# Altium project STM32_Serial_Ethernet.PrjPcb
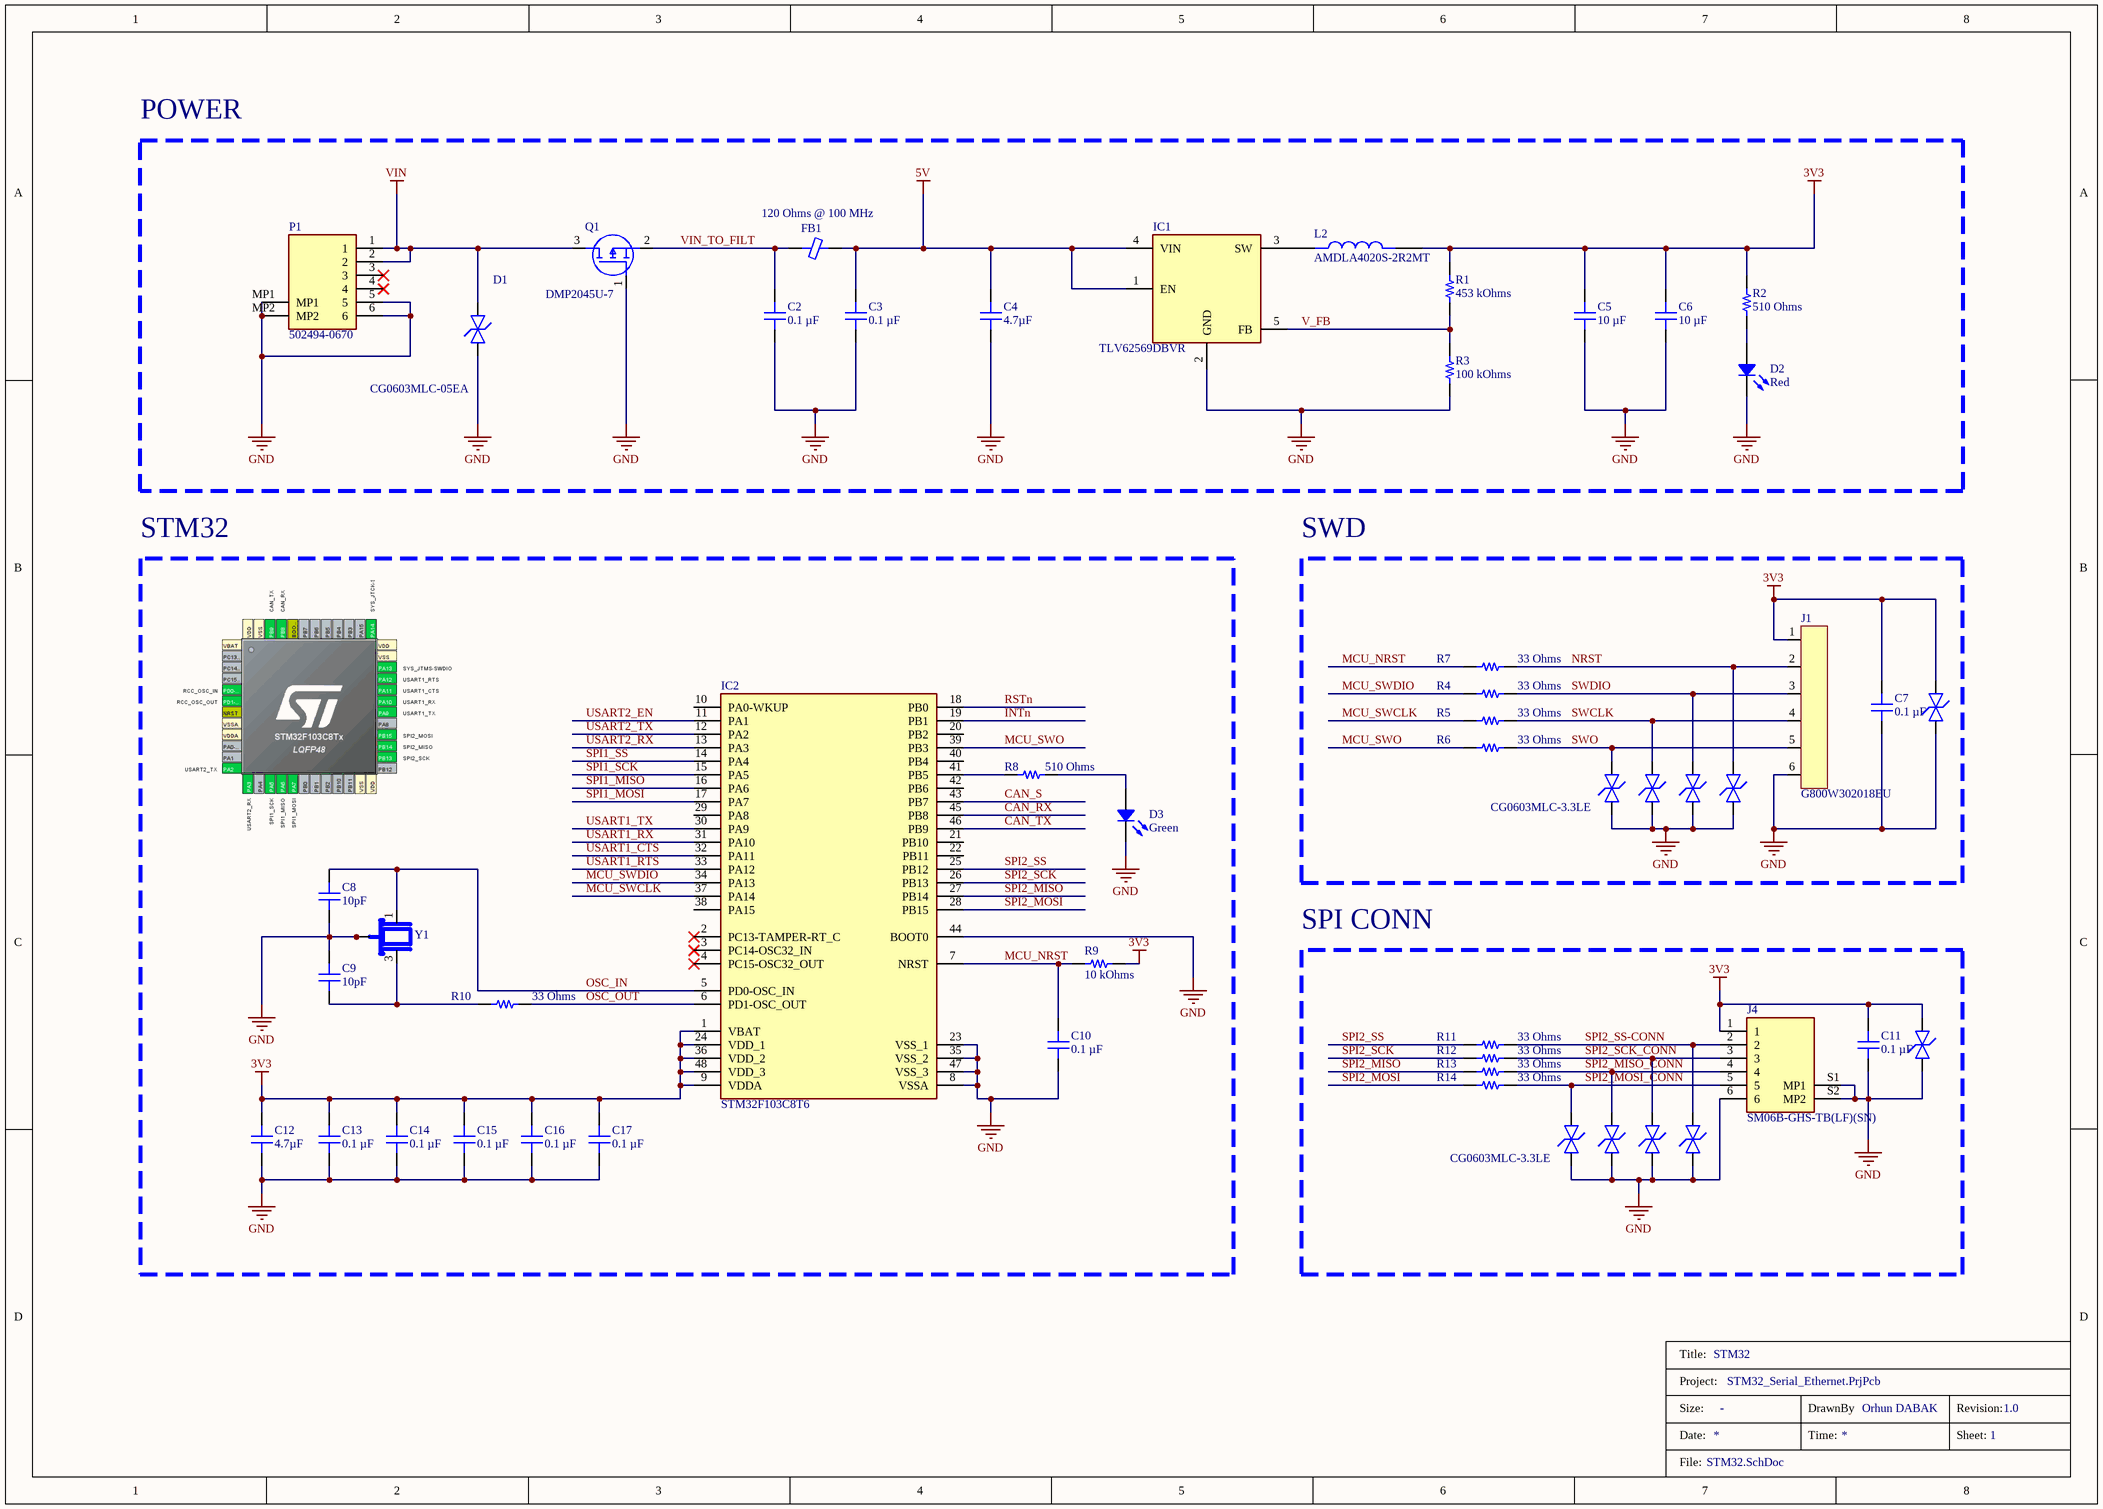
[diagram p0: STM32.SchDoc]
3 sheets, 124 parts. Net scope: global (net labels, ports and power ports of the same name join across sheets).
Board file: STM32_Serial_Ethernet.PcbDoc
Sheets:
  STM32.SchDoc
  Ethernet.SchDoc
  Serial.SchDoc

## Sheet STM32.SchDoc: STM32
size A3; Author: Orhun DABAK; DrawnBy: Orhun DABAK; Revision: 1.0; SheetNumber: 1; SheetTotal: 3

### Parts
(Parts that share a designator on the sheet are numbered #1, #2 ... from top to bottom, then left to right.)
*#1  Title_Block  (value not drawn)  (graphical)
C2  0.1 µF  [CAP 0603_1608]
C3  0.1 µF  [CAP 0603_1608]
C4  4.7µF  [CAP 0805_2012]
C5  10 µF  [CAP 0805_2012]
C6  10 µF  [CAP 0805_2012]
C7  0.1 µF  [CAP 0603_1608]
C8  10pF  [CAP 0603_1608]
C9  10pF  [CAP 0603_1608]
C10  0.1 µF  [CAP 0603_1608]
C11  0.1 µF  [CAP 0603_1608]
C12  4.7µF  [CAP 0805_2012]
C13  0.1 µF  [CAP 0603_1608]
C14  0.1 µF  [CAP 0603_1608]
C15  0.1 µF  [CAP 0603_1608]
C16  0.1 µF  [CAP 0603_1608]
C17  0.1 µF  [CAP 0603_1608]
D1  CG0603MLC-05EA  [DIONC1608X55N]
D2  Red  [LED 0603_1608 RED]
D3  Green  [LED 0603_1608 GREEN]
FB1  120 Ohms @ 100 MHz  [FER 0603_1608]
IC1  TLV62569DBVR  [SOT95P280X145-5N]
IC2  STM32F103C8T6  [QFP50P900X900X160-48N]
J1  G800W302018EU  [G800W302018EU]
J4  SM06B-GHS-TB(LF)(SN)  [JST_SM06B-GHS-TB(LF)(SN)]
L2  AMDLA4020S-2R2MT  [IND_AMDLA4020S-2R2MT]
P1  502494-0670  [MOLEX_502494-0670]
Q1  DMP2045U-7  [SOT96P240X110-3N]
R1  453 kOhms  [RES 0603_1608]
R2  510 Ohms  [RES 0603_1608]
R3  100 kOhms  [RES 0603_1608]
R4  33 Ohms  [RES 0603_1608]
R5  33 Ohms  [RES 0603_1608]
R6  33 Ohms  [RES 0603_1608]
R7  33 Ohms  [RES 0603_1608]
R8  510 Ohms  [RES 0603_1608]
R9  10 kOhms  [RES 0603_1608]
R10  33 Ohms  [RES 0603_1608]
R11  33 Ohms  [RES 0603_1608]
R12  33 Ohms  [RES 0603_1608]
R13  33 Ohms  [RES 0603_1608]
R14  33 Ohms  [RES 0603_1608]
RV1  CG0603MLC-3.3LE  [VARC1608X55N]  (value not drawn)
RV2  CG0603MLC-3.3LE  [VARC1608X55N]
RV3  CG0603MLC-3.3LE  [VARC1608X55N]  (value not drawn)
RV4  CG0603MLC-3.3LE  [VARC1608X55N]  (value not drawn)
RV5  CG0603MLC-3.3LE  [VARC1608X55N]  (value not drawn)
RV6  CG0603MLC-3.3LE  [VARC1608X55N]  (value not drawn)
RV7  CG0603MLC-3.3LE  [VARC1608X55N]
RV8  CG0603MLC-3.3LE  [VARC1608X55N]  (value not drawn)
RV9  CG0603MLC-3.3LE  [VARC1608X55N]  (value not drawn)
RV10  CG0603MLC-3.3LE  [VARC1608X55N]  (value not drawn)
Y1  X322516MLB4SI  [X322516MLB4SI]  (value not drawn)

### Blocks framed on the sheet
POWER: C2-C6 D1 D2 FB1 IC1 L2 P1 Q1 R1-R3
STM32: C8-C10 C12-C17 D3 IC2 R8-R10 Y1
SWD: C7 J1 R4-R7 RV1-RV5
SPI CONN: C11 J4 R11-R14 RV6-RV10

### Nets
3V3: C5.2 C6.2 C7.1 C11.2 C12.2 C13.1 C14.1 C15.1 C16.1 C17.1 IC2.1(VBAT) IC2.9(VDDA) IC2.24(VDD_1) IC2.36(VDD_2) IC2.48(VDD_3) J1.1 J4.1 L2.2 R1.2 R2.2 R9.1 RV1.2 RV6.2
5V: C3.2 C4.2 FB1.2 IC1.1(EN) IC1.4(VIN)
GND: C2.1 C3.1 C4.1 C5.1 C6.1 C7.2 C8.1 C9.1 C10.2 C11.1 C12.1 C13.2 C14.2 C15.2 C16.2 C17.2 D1.1 D2.2 D3.2 IC1.2(GND) IC2.8(VSSA) IC2.23(VSS_1) IC2.35(VSS_2) IC2.44(BOOT0) IC2.47(VSS_3) J1.6 J4.6 J4.S1(MP1) J4.S2(MP2) P1.5 P1.6 P1.MP1 P1.MP2 Q1.1(G) R3.2 RV1.1 RV2.1 RV3.1 RV4.1 RV5.1 RV6.1 RV7.1 RV8.1 RV9.1 RV10.1 Y1.2(GND) Y1.4(GND)
VIN: D1.2 P1.1 P1.2 Q1.3(D)
CAN_RX: IC2.45(PB8)
CAN_S: IC2.43(PB7)
CAN_TX: IC2.46(PB9)
INTn: IC2.19(PB1)
MCU_NRST: C10.1 IC2.7(NRST) R7.1 R9.2
MCU_SWCLK: IC2.37(PA14) R5.1
MCU_SWDIO: IC2.34(PA13) R4.1
MCU_SWO: IC2.39(PB3) R6.1
NRST: J1.2 R7.2 RV2.2
OSC_IN: C8.2 IC2.5(PD0-OSC_IN) Y1.1
OSC_OUT: IC2.6(PD1-OSC_OUT) R10.2
RSTn: IC2.18(PB0)
SPI1_MISO: IC2.16(PA6)
SPI1_MOSI: IC2.17(PA7)
SPI1_SCK: IC2.15(PA5)
SPI1_SS: IC2.14(PA4)
SPI2_MISO: IC2.27(PB14) R13.1
SPI2_MISO_CONN: J4.4 R13.2 RV8.2
SPI2_MOSI: IC2.28(PB15) R14.1
SPI2_MOSI_CONN: J4.5 R14.2 RV7.2
SPI2_SCK: IC2.26(PB13) R12.1
SPI2_SCK_CONN: J4.3 R12.2 RV9.2
SPI2_SS: IC2.25(PB12) R11.1
SPI2_SS-CONN: J4.2 R11.2 RV10.2
SWCLK: J1.4 R5.2 RV4.2
SWDIO: J1.3 R4.2 RV5.2
SWO: J1.5 R6.2 RV3.2
USART1_CTS: IC2.32(PA11)
USART1_RTS: IC2.33(PA12)
USART1_RX: IC2.31(PA10)
USART1_TX: IC2.30(PA9)
USART2_EN: IC2.11(PA1)
USART2_RX: IC2.13(PA3)
USART2_TX: IC2.12(PA2)
V_FB: IC1.5(FB) R1.1 R3.1
VIN_TO_FILT: C2.2 FB1.1 Q1.2(S)
NetC9_2: C9.2 R10.1 Y1.3
NetD2_1: D2.1 R2.1
NetD3_1: D3.1 R8.1
NetIC1_3: IC1.3(SW) L2.1
NetIC2_41: IC2.41(PB5) R8.2

Not connected (* = marked no-connect by the designer): IC2 2(PC13-TAMPER-RT_C)* 3(PC14-OSC32_IN)* 4(PC15-OSC32_OUT)* 10(PA0-WKUP) 20(PB2) 21(PB10) 22(PB11) 29(PA8) 38(PA15) 40(PB4) 42(PB6); P1 3* 4*

### Notes on the sheet
- (in symbol Title_Block) Title:; Project:; Size:; DrawnBy; Revision:; Date:; Time:; Sheet:; File:

### Library data of the parts
*#1 = Title_Block: Standart Title Block; Size: -
C2 C3 C7 C10 C11 C13-C17 = CS0603KRX7R7BB104: CAP CER 0.1UF 16V X7R 0603; manufacturer: Yageo; Tolerance: ±10%; Part Number: CS0603KRX7R7BB104; Value: 0.1 µF; Applications: Boardflex Sensitive; Capacitance: 0.1 µF; componentlink1description: Datasheet; componentlink1url: http://www.yageo.com/NewPortal/yageodocoutput?fileName=/pdf/MLCC/UPY-ST_NPOX7R_16V-to-3KV_5.pdf; componentlink2description: DigiKey Link; componentlink2url: https://www.digikey.com/en/products/detail/yageo/CS0603KRX7R7BB104/6097897; Device Package: 0603 (1608 Metric); Features: Soft Termination; lastupdated: 3/3/2023 08:08:52 PM; Lifecycle Status: Active; Minimum Order: 1; Mounting Type: Surface Mount, MLCC; Operating Temperature: -55°C ~ 125°C; Package / Case: 0603 (1608 Metric); packaging: TapeAndReel; partid: 2286; Part Status: Active; price: 0.01; series: CS; Size / Dimension: 0.063" L x 0.031" W (1.60mm x 0.80mm); Supplier 1: DigiKey; Supplier Part Number 1: 311-3560-1-ND; Temperature Coefficient: X7R; Thickness (Max): 0.037" (0.95mm); Voltage - Rated: 16V
C4 C12 = 0805YC475MAT2A: CAP CER 4.7UF 16V X7R 0805; manufacturer: AVX Corporation; Tolerance: ±20%; Part Number: 0805YC475MAT2A; Value: 4.7µF; Applications: General Purpose; Capacitance: 4.7µF; componentlink1description: Datasheet; componentlink1url: http://datasheets.avx.com/X7RDielectric.pdf; componentlink2description: DigiKey Link; componentlink2url: http://digikey.com/product-detail/en/avx-corporation/0805YC475MAT2A/478-10575-1-ND/6797621; Device Package: 0805 (2012 Metric); lastupdated: 9/2/2020 01:04:40 AM; Lifecycle Status: Active; Minimum Order: 1; Mounting Type: Surface Mount, MLCC; Operating Temperature: -55°C ~ 125°C; Package / Case: 0805 (2012 Metric); packaging: TapeAndReel; partid: 3443; Part Status: Active; price: 0.12; series: -; Size / Dimension: 0.079" L x 0.049" W (2.01mm x 1.25mm); Supplier 1: DigiKey; Supplier Part Number 1: 478-10575-1-ND; Temperature Coefficient: X7R; Thickness (Max): 0.060" (1.52mm); Voltage - Rated: 16V
C5 C6 = C2012X6S1C106K125AC: CAP CER 10UF 16V X6S 0805; manufacturer: TDK Corporation; Tolerance: ±10%; Part Number: C2012X6S1C106K125AC; Value: 10 µF; Applications: General Purpose; Capacitance: 10 µF; componentlink1description: Datasheet; componentlink1url: https://product.tdk.com/info/en/catalog/datasheets/mlcc_commercial_general_en.pdf?ref_disty=digikey; componentlink2description: DigiKey Link; componentlink2url: https://www.digikey.com/en/products/detail/tdk-corporation/C2012X6S1C106K125AC/2733046; Device Package: 0805 (2012 Metric); Features: Low ESL; lastupdated: 3/3/2023 08:12:18 PM; Lifecycle Status: Active; Minimum Order: 1; Mounting Type: Surface Mount, MLCC; Operating Temperature: -55°C ~ 105°C; Package / Case: 0805 (2012 Metric); packaging: TapeAndReel; partid: 2995; Part Status: Active; price: 0.07; series: C; Size / Dimension: 0.079" L x 0.049" W (2.00mm x 1.25mm); Supplier 1: DigiKey; Supplier Part Number 1: 445-7611-1-ND; Temperature Coefficient: X6S; Thickness (Max): 0.057" (1.45mm); Voltage - Rated: 16V
C8 C9 = 06035A100J4T2A: CAP CER 10PF 50V NP0 0603; manufacturer: AVX Corporation; Temperature Coefficient: C0G, NP0; Tolerance: ±5%; Part Number: 06035A100J4T2A; Value: 10pF; Applications: Automotive; Capacitance: 10pF; componentlink1description: Datasheet; componentlink1url: http://datasheets.avx.com/AutoMLCC.pdf; componentlink2description: DigiKey Link; componentlink2url: http://digikey.com/product-detail/en/avx-corporation/06035A100J4T2A/478-11607-1-ND/8564165; Device Package: 0603 (1608 Metric); lastupdated: 9/2/2020 01:03:34 AM; Lifecycle Status: Active; Minimum Order: 1; Mounting Type: Surface Mount, MLCC; Operating Temperature: -55°C ~ 125°C; Package / Case: 0603 (1608 Metric); packaging: TapeAndReel; partid: 3073; Part Status: Active; price: 0.04; Ratings: AEC-Q200; series: -; Size / Dimension: 0.063" L x 0.031" W (1.60mm x 0.80mm); Supplier 1: DigiKey; Supplier Part Number 1: 478-11607-1-ND; Thickness (Max): 0.035" (0.90mm); Voltage - Rated: 50V
D1 = CG0603MLC-05EA: TVS Diode (Bi-directional); Manufacturer_Name: Bourns; Datasheet Link: https://datasheet.datasheetarchive.com/originals/dk/DKDS-12/224862.pdf; Height: 0.55mm; Manufacturer_Part_Number: CG0603MLC-05EA
D2 = LTST-C193KRKT-2A: LED RED CLEAR CHIP SMD; Manufacturer: Lite-On Inc.; Configuration: Standard; Current - Test: 2mA; Lens Color: Colorless; Lens Size: 1.15mm x 0.80mm; Lens Style: Rectangle with Flat Top; Millicandela Rating: 6.5mcd; Viewing Angle: 130°; Voltage - Forward (Vf) (Typ): 1.9V; Wavelength - Dominant: 629nm; Wavelength - Peak: 639nm; Part Number: LTST-C193KRKT-2A; Color: Red; ComponentLink1Description: Datasheet; ComponentLink1URL: //media.digikey.com/pdf/Data%20Sheets/Lite-On%20PDFs/LTST-C193KRKT-2A.pdf; ComponentLink2Description: DigiKey Link; ComponentLink2URL: http://digikey.com/product-detail/en/lite-on-inc/LTST-C193KRKT-2A/160-1909-1-ND/3694456; Device Package: 0603 (1608 Metric); Height (Max): 0.35mm; LastUpdated: 3/3/2023 08:56:33 PM; Lens Transparency: Clear; Lifecycle Status: Active; Minimum Order: 1; Mounting Type: Surface Mount; Package / Case: 0603 (1608 Metric); Packaging: TapeAndReel; PartId: 382; Part Status: Active; Price: 0.07; Series: -; Size / Dimension: 1.60mm L x 0.80mm W; Supplier 1: DigiKey; Supplier Part Number 1: 160-1909-1-ND; Supplier Device Package: Chip LED; Value: Red
D3 = LSM0603453V: LED SM 0603 3V -/1000/-MCD GREEN; Manufacturer: Visual Communications Company - VCC; Configuration: Standard; Current - Test: 20mA; Lens Color: Colorless; Lens Size: 1.20mm x 0.80mm; Lens Style: Rectangle with Flat Top; Lens Transparency: Clear; Millicandela Rating: 63mcd; Viewing Angle: 120°; Voltage - Forward (Vf) (Typ): 2V; Wavelength - Dominant: 572nm; Wavelength - Peak: 571nm; Part Number: LSM0603453V; Color: Green; ComponentLink1Description: Datasheet; ComponentLink1URL: https://vcclite.com/wp-content/uploads/wpallimport/files/files/LSM0603453V.pdf; ComponentLink2Description: DigiKey Link; ComponentLink2URL: https://www.digikey.com/en/products/detail/visual-communications-company-vcc/LSM0603453V/9486724; Device Package: 0603 (1608 Metric); Height (Max): 0.65mm; LastUpdated: 3/3/2023 08:56:02 PM; Lifecycle Status: Active; Minimum Order: 1; Mounting Type: Surface Mount; Package / Case: 0603 (1608 Metric); Packaging: TapeAndReel; PartId: 579; Part Status: Active; Price: 0.08; Series: LSM0603; Size / Dimension: 1.60mm L x 0.80mm W; Supplier 1: DigiKey; Supplier Part Number 1: LSM0603453VCT-ND; Supplier Device Package: Chip LED; Value: Green
FB1 = 742792625: FERRITE BEAD 120 OHM 0603 1LN; Manufacturer: Würth Elektronik; Current Rating (Max): 2A; DC Resistance (DCR) (Max): 50mOhm; Filter Type: Signal Line; Number of Lines: 1; Part Number: 742792625; ComponentLink1Description: Datasheet; ComponentLink1URL: https://katalog.we-online.de/pbs/datasheet/742792625.pdf; ComponentLink2Description: DigiKey Link; ComponentLink2URL: https://www.digikey.com/en/products/detail/würth-elektronik/742792625/4310426; Device Package: 0603 (1608 Metric); Height (Max): 0.039" (1.00mm); Impedance @ Frequency: 120 Ohms @ 100 MHz; LastUpdated: 3/3/2023 08:50:24 PM; Lifecycle Status: Active; Minimum Order: 1; Mounting Type: Surface Mount; Operating Temperature: -55°C ~ 125°C; Package / Case: 0603 (1608 Metric); Packaging: TapeAndReel; PartId: 1102; Part Status: Active; Price: 0.10; Ratings: AEC-Q200; Series: WE-CBF; Size / Dimension: 0.063" L x 0.032" W (1.60mm x 0.80mm); Supplier 1: DigiKey; Supplier Part Number 1: 732-4665-1-ND; Value: 120 Ohms @ 100 MHz
IC1 = TLV62569DBVR: Integrated Circuit; Manufacturer_Name: Texas Instruments; Datasheet Link: http://www.ti.com/lit/gpn/tlv62569; Height: 1.45mm; Manufacturer_Part_Number: TLV62569DBVR; Mouser Part Number: 595-TLV62569DBVR; Mouser Price/Stock: https://www.mouser.co.uk/ProductDetail/Texas-Instruments/TLV62569DBVR?qs=0C8XhJW8e4oaylc%252BzBrCmA%3D%3D; Arrow Part Number: TLV62569DBVR; Arrow Price/Stock: https://www.arrow.com/en/products/tlv62569dbvr/texas-instruments?region=nac
IC2 = STM32F103C8T6: Integrated Circuit; Manufacturer_Name: STMicroelectronics; Datasheet Link: https://www.st.com/resource/en/datasheet/stm32f103c8.pdf; Height: 1.6mm; Manufacturer_Part_Number: stm32f103c8t6; Mouser Part Number: 511-STM32F103C8T6; Mouser Price/Stock: https://www.mouser.co.uk/ProductDetail/STMicroelectronics/STM32F103C8T6?qs=bhCVus9SdFtq6kqxsU5%2FDA%3D%3D; Arrow Part Number: STM32F103C8T6; Arrow Price/Stock: https://www.arrow.com/en/products/stm32f103c8t6/stmicroelectronics?region=nac
J1 = G800W302018EU: Pin Header 6 Position 2.54mm Pitch; Manufacturer: Amphenol; Manufacturer Part Number: G800W302018EU
J4 = SM06B-GHS-TB(LF)(SN): ÐŸÐ¾Ð²ÐµÑ€Ñ…Ð½Ð¾ÑÑ‚Ð½Ñ‹Ð¹ Ð¼Ð¾Ð½Ñ‚Ð°Ð¶ Ñ€Ð°Ð·ÑŠÐµÐ¼Ð°, Ð¿Ñ€ÑÐ¼Ð¾Ð¹ ÑƒÐ³Ð¾Ð» 6, Ð¿Ð¾Ð»Ð¾Ð¶ÐµÐ½Ð¸Ðµ 0,049 _1,25 Ð¼Ð¼_; MP: SM06B-GHS-TB_LF__SN_; MF: JST Sales; Value: *; Package: None; Price: None; Availability: Unavailable; SnapEDA_Link: https://www.snapeda.com/parts/SM06B-GHS-TB%28LF%29%28SN%29/JST%20Sales%20America%20Inc./view-part/817690/?ref=snap
L2 = AMDLA4020S-2R2MT: Power Inductor (SMD), 2.2 uH, Â± 20%, 4.5 A, Shielded, 6 A, 4.4mm x 4mm x 1.8mm; MF: Abracon Corporation; Purchase-URL: https://pricing.snapeda.com/search/part/AMDLA4020S-2R2MT/?ref=eda; Package: Package; MP: AMDLA4020S-2R2MT; Value: *; SnapEDA_Link: https://www.snapeda.com/parts/AMDLA4020S-2R2MT/Abracon/view-part/?ref=snap; Availability: In Stock; Price: None; Check_prices: https://www.snapeda.com/parts/AMDLA4020S-2R2MT/Abracon/view-part/?ref=eda
P1 = 502494-0670: 2.00mm Pitch CLIK-Mateâ„¢ Wire-to-Board PCB Receptacle, Single Row, Right Angle, 6 Circuits; Package: None; Price: None; Value: *; MP: 502494-0670; Availability: Unavailable
Q1 = DMP2045U-7: MOSFET (P-Channel); Manufacturer_Name: Diodes Inc.; Datasheet Link: https://www.diodes.com/assets/Datasheets/DMP2045U.pdf; Height: 1.1mm; Manufacturer_Part_Number: DMP2045U-7; Mouser Part Number: 621-DMP2045U-7; Mouser Price/Stock: https://www.mouser.co.uk/ProductDetail/Diodes-Incorporated/DMP2045U-7?qs=rrS6PyfT74erdUwo5CgHTg%3D%3D; Arrow Part Number: DMP2045U-7; Arrow Price/Stock: https://www.arrow.com/en/products/dmp2045u-7/diodes-incorporated?region=nac
R1 = SDR03EZPF4533: RES SMD 453 KOHM 1% 0.3W 0603; Manufacturer: Rohm Semiconductor; Temperature Coefficient: ±100ppm/°C; Part Number: SDR03EZPF4533; Value: 453 kOhms; ComponentLink1Description: Datasheet; ComponentLink1URL: https://www.rohm.com/datasheet/SDR03EZPF/sdr-e; ComponentLink2Description: DigiKey Link; ComponentLink2URL: https://www.digikey.com/en/products/detail/rohm-semiconductor/SDR03EZPF4533/9674970; Composition: Thick Film; Device Package: 0603 (1608 Metric); Features: Pulse Withstanding; Height - Seated (Max): 0.022" (0.55mm); LastUpdated: 3/3/2023 08:29:48 PM; Lifecycle Status: Active; Minimum Order: 1; Number of Terminations: 2; Operating Temperature: -55°C ~ 155°C; Package / Case: 0603 (1608 Metric); Packaging: TapeAndReel; PartId: 5359; Part Status: Active; Power (Watts): 0.3W; Price: 0.02; Resistance: 453 kOhms; Series: SDR03; Size / Dimension: 0.063" L x 0.031" W (1.60mm x 0.80mm); Supplier 1: DigiKey; Supplier Part Number 1: 511-1720-1-ND; Supplier Device Package: 0603; Tolerance: ±1%
R2 R8 = RMCF0603JT510R: RES 510 OHM 5% 1/10W 0603; Manufacturer: Stackpole Electronics Inc; Power (Watts): 0.1W, 1/10W; Temperature Coefficient: ±200ppm/°C; Part Number: RMCF0603JT510R; Value: 510 Ohms; ComponentLink1Description: Datasheet; ComponentLink1URL: https://www.seielect.com/catalog/sei-rmcf_rmcp.pdf; ComponentLink2Description: DigiKey Link; ComponentLink2URL: https://www.digikey.com/en/products/detail/stackpole-electronics-inc/RMCF0603JT510R/1757941; Composition: Thick Film; Device Package: 0603 (1608 Metric); Features: Automotive AEC-Q200; Height - Seated (Max): 0.022" (0.55mm); LastUpdated: 3/3/2023 08:29:46 PM; Lifecycle Status: Active; Minimum Order: 1; Number of Terminations: 2; Operating Temperature: -55°C ~ 155°C; Package / Case: 0603 (1608 Metric); Packaging: CutTape; PartId: 5929; Part Status: Active; Price: 0.01; Ratings: AEC-Q200; Resistance: 510 Ohms; Series: RMCF; Size / Dimension: 0.061" L x 0.031" W (1.55mm x 0.80mm); Supplier 1: DigiKey; Supplier Part Number 1: RMCF0603JT510RCT-ND; Supplier Device Package: 0603; Tolerance: ±5%
R3 = RT0603FRE07100KL: RES SMD 100K OHM 1% 1/10W 0603; Manufacturer: Yageo; Power (Watts): 0.1W, 1/10W; Temperature Coefficient: ±50ppm/°C; Part Number: RT0603FRE07100KL; Value: 100 kOhms; ComponentLink1Description: Datasheet; ComponentLink1URL: https://www.yageo.com/upload/media/product/productsearch/datasheet/rchip/PYu-RT_1-to-0.01_RoHS_L_11.pdf; ComponentLink2Description: DigiKey Link; ComponentLink2URL: https://www.digikey.com/en/products/detail/yageo/RT0603FRE07100KL/1075029; Composition: Thin Film; Device Package: 0603 (1608 Metric); Height - Seated (Max): 0.022" (0.55mm); LastUpdated: 3/3/2023 08:29:47 PM; Lifecycle Status: Active; Minimum Order: 1; Number of Terminations: 2; Operating Temperature: -55°C ~ 155°C; Package / Case: 0603 (1608 Metric); Packaging: TapeAndReel; PartId: 5677; Part Status: Active; Price: 0.01; Resistance: 100 kOhms; Series: RT; Size / Dimension: 0.063" L x 0.031" W (1.60mm x 0.80mm); Supplier 1: DigiKey; Supplier Part Number 1: YAG2319CT-ND; Supplier Device Package: 0603; Tolerance: ±1%
R4-R7 R10-R14 = RMCF0603JT33R0: RES 33 OHM 5% 1/10W 0603; Manufacturer: Stackpole Electronics Inc; Power (Watts): 0.1W, 1/10W; Temperature Coefficient: ±200ppm/°C; Part Number: RMCF0603JT33R0; Value: 33 Ohms; ComponentLink1Description: Datasheet; ComponentLink1URL: https://www.seielect.com/catalog/sei-rmcf_rmcp.pdf; ComponentLink2Description: DigiKey Link; ComponentLink2URL: https://www.digikey.com/en/products/detail/stackpole-electronics-inc/RMCF0603JT33R0/1758048; Composition: Thick Film; Device Package: 0603 (1608 Metric); Features: Automotive AEC-Q200; Height - Seated (Max): 0.022" (0.55mm); LastUpdated: 3/3/2023 08:29:46 PM; Lifecycle Status: Active; Minimum Order: 1; Number of Terminations: 2; Operating Temperature: -55°C ~ 155°C; Package / Case: 0603 (1608 Metric); Packaging: CutTape; PartId: 5849; Part Status: Active; Price: 0.01; Ratings: AEC-Q200; Resistance: 33 Ohms; Series: RMCF; Size / Dimension: 0.061" L x 0.031" W (1.55mm x 0.80mm); Supplier 1: DigiKey; Supplier Part Number 1: RMCF0603JT33R0CT-ND; Supplier Device Package: 0603; Tolerance: ±5%
R9 = CRCW060310K0JNEA: RES SMD 10K OHM 5% 1/10W 0603; Manufacturer: Vishay Dale; Power (Watts): 0.1W, 1/10W; Temperature Coefficient: ±200ppm/°C; Part Number: CRCW060310K0JNEA; Value: 10 kOhms; ComponentLink1Description: Datasheet; ComponentLink1URL: http://www.vishay.com/docs/20035/dcrcwe3.pdf; ComponentLink2Description: DigiKey Link; ComponentLink2URL: http://digikey.com/product-detail/en/vishay-dale/CRCW060310K0JNEA/541-10KGCT-ND/1179393; Composition: Thick Film; Device Package: 0603 (1608 Metric); Features: Automotive AEC-Q200; Height - Seated (Max): 0.020" (0.50mm); LastUpdated: 3/3/2023 08:29:48 PM; Lifecycle Status: Active; Minimum Order: 1; Number of Terminations: 2; Operating Temperature: -55°C ~ 155°C; Package / Case: 0603 (1608 Metric); Packaging: CutTape; PartId: 5216; Part Status: Active; Price: 0.10; Ratings: AEC-Q200; Resistance: 10 kOhms; Series: CRCW; Size / Dimension: 0.063" L x 0.033" W (1.60mm x 0.85mm); Supplier 1: DigiKey; Supplier Part Number 1: 541-10KGCT-ND; Supplier Device Package: 0603; Tolerance: ±5%
RV1-RV10 = CG0603MLC-3.3LE: Varistor; Manufacturer_Name: Bourns; Datasheet Link: https://www.bourns.com/docs/Product-Datasheets/MLC.pdf; Height: 0.55mm; Manufacturer_Part_Number: CG0603MLC-3.3LE; Mouser Part Number: 652-CG0603MLC-3.3LE; Mouser Price/Stock: https://www.mouser.co.uk/ProductDetail/Bourns/CG0603MLC-3.3LE?qs=m8myXnDJXpXlL5%252BDNWWe1g%3D%3D; Arrow Part Number: CG0603MLC-3.3LE; Arrow Price/Stock: https://www.arrow.com/en/products/cg0603mlc-3.3le/bourns?region=nac
Y1 = X322516MLB4SI: Crystal or Oscillator; Manufacturer_Name: Yangxing Tech; Datasheet Link: https://datasheet.lcsc.com/szlcsc/Yangxing-Tech-X322516MLB4SI_C13738.pdf; Height: 0.8mm; Manufacturer_Part_Number: X322516MLB4SI

## Sheet Ethernet.SchDoc: Ethernet
size A3; Author: Orhun DABAK; DrawnBy: Orhun DABAK; Revision: 1.0; SheetNumber: 2; SheetTotal: 3
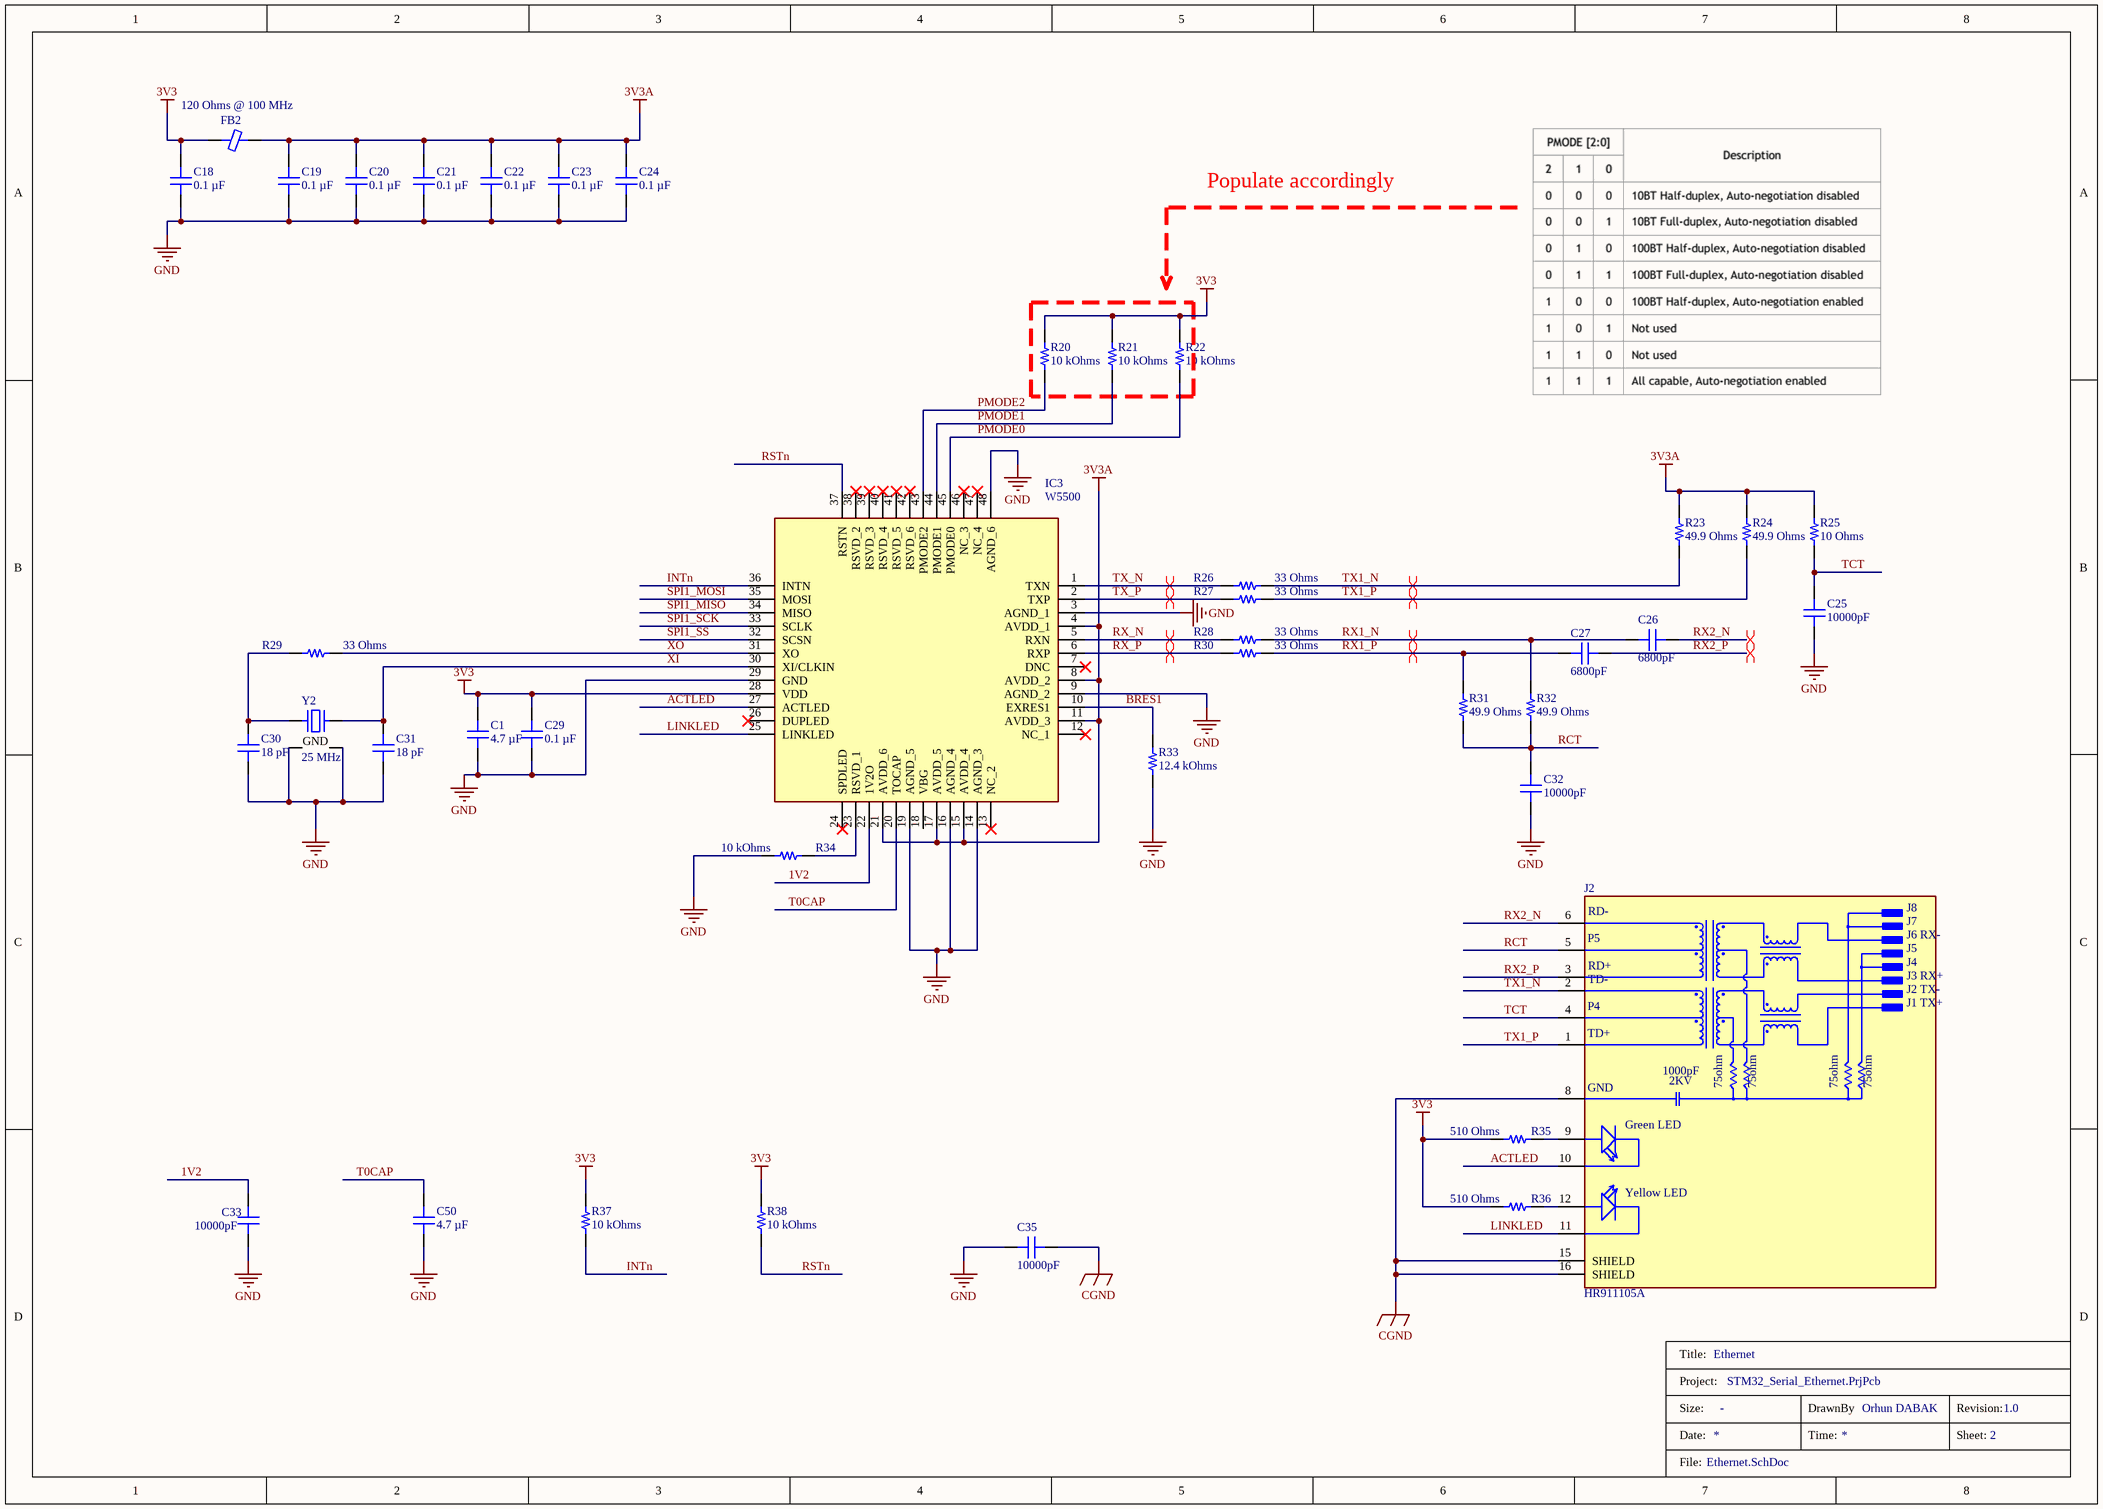
[diagram p1: Ethernet.SchDoc]

### Parts
(Parts that share a designator on the sheet are numbered #1, #2 ... from top to bottom, then left to right.)
*#2  Title_Block  (value not drawn)  (graphical)
C1  4.7 µF  [CAP 0603_1608]
C18  0.1 µF  [CAP 0603_1608]
C19  0.1 µF  [CAP 0603_1608]
C20  0.1 µF  [CAP 0603_1608]
C21  0.1 µF  [CAP 0603_1608]
C22  0.1 µF  [CAP 0603_1608]
C23  0.1 µF  [CAP 0603_1608]
C24  0.1 µF  [CAP 0603_1608]
C25  10000pF  [CAP 0603_1608]
C26  6800pF  [CAP 0603_1608]
C27  6800pF  [CAP 0603_1608]
C29  0.1 µF  [CAP 0603_1608]
C30  18 pF  [CAP 0603_1608]
C31  18 pF  [CAP 0603_1608]
C32  10000pF  [CAP 0603_1608]
C33  10000pF  [CAP 0603_1608]
C35  10000pF  [CAP 0603_1608]
C50  4.7 µF  [CAP 0603_1608]
FB2  120 Ohms @ 100 MHz  [FER 0603_1608]
IC3  W5500  [QFP50P900X900X160-48N]
J2  HR911105A  [HANRUN_HR911105A]
R20  10 kOhms  [RES 0603_1608]
R21  10 kOhms  [RES 0603_1608]
R22  10 kOhms  [RES 0603_1608]
R23  49.9 Ohms  [RES 0603_1608]
R24  49.9 Ohms  [RES 0603_1608]
R25  10 Ohms  [RES 0603_1608]
R26  33 Ohms  [RES 0603_1608]
R27  33 Ohms  [RES 0603_1608]
R28  33 Ohms  [RES 0603_1608]
R29  33 Ohms  [RES 0603_1608]
R30  33 Ohms  [RES 0603_1608]
R31  49.9 Ohms  [RES 0603_1608]
R32  49.9 Ohms  [RES 0603_1608]
R33  12.4 kOhms  [RES 0603_1608]
R34  10 kOhms  [RES 0603_1608]
R35  510 Ohms  [RES 0603_1608]
R36  510 Ohms  [RES 0603_1608]
R37  10 kOhms  [RES 0603_1608]
R38  10 kOhms  [RES 0603_1608]
Y2  25 MHz  [EPSON TSX-3225]

### Nets
3V3: C1.2 C18.1 C29.1 FB2.1 IC3.28(VDD) R20.2 R21.2 R22.2 R35.2 R36.2 R37.1 R38.2
3V3A: C19.1 C20.1 C21.1 C22.1 C23.1 C24.1 FB2.2 IC3.4(AVDD_1) IC3.8(AVDD_2) IC3.11(AVDD_3) IC3.15(AVDD_4) IC3.17(AVDD_5) IC3.21(AVDD_6) R23.2 R24.2 R25.2
CGND: C35.1 J2.8(GND) J2.15(SHIELD) J2.16(SHIELD)
GND: C1.1 C18.2 C19.2 C20.2 C21.2 C22.2 C23.2 C24.2 C25.1 C29.2 C30.1 C31.1 C32.1 C33.1 C35.2 C50.1 IC3.3(AGND_1) IC3.9(AGND_2) IC3.14(AGND_3) IC3.16(AGND_4) IC3.19(AGND_5) IC3.29(GND) IC3.48(AGND_6) R33.1 R34.2 Y2.2(GND) Y2.4(GND)
1V2: C33.2 IC3.22(1V2O)
ACTLED: IC3.27(ACTLED) J2.10(GC)
BRES1: IC3.10(EXRES1) R33.2
INTn: IC3.36(INTN) R37.2
LINKLED: IC3.25(LINKLED) J2.11(YC)
PMODE0: IC3.45(PMODE0) R22.1
PMODE1: IC3.44(PMODE1) R21.1
PMODE2: IC3.43(PMODE2) R20.1
RCT: C32.2 J2.5(P5) R31.1 R32.1
RSTn: IC3.37(RSTN) R38.1
RX1_N: C26.1 R28.2 R32.2
RX1_P: C27.1 R30.2 R31.2
RX2_N: C26.2 J2.6(RD-)
RX2_P: C27.2 J2.3(RD+)
RX_N: IC3.5(RXN) R28.1
RX_P: IC3.6(RXP) R30.1
SPI1_MISO: IC3.34(MISO)
SPI1_MOSI: IC3.35(MOSI)
SPI1_SCK: IC3.33(SCLK)
SPI1_SS: IC3.32(SCSN)
T0CAP: C50.2 IC3.20(TOCAP)
TCT: C25.2 J2.4(P4) R25.1
TX1_N: J2.2(TD-) R23.1 R26.2
TX1_P: J2.1(TD+) R24.1 R27.2
TX_N: IC3.1(TXN) R26.1
TX_P: IC3.2(TXP) R27.1
XI: C31.2 IC3.30(XI/CLKIN) Y2.3
XO: IC3.31(XO) R29.2
NetC30_2: C30.2 R29.1 Y2.1
NetIC3_23: IC3.23(RSVD_1) R34.1
NetJ2_9: J2.9(GA) R35.1
NetJ2_12: J2.12(YA) R36.1

Not connected (* = marked no-connect by the designer): IC3 7(DNC)* 12(NC_1)* 13(NC_2)* 18(VBG) 24(SPDLED)* 26(DUPLED)* 38(RSVD_2)* 39(RSVD_3)* 40(RSVD_4)* 41(RSVD_5)* 42(RSVD_6)* 46(NC_3)* 47(NC_4)*

### Layout directives
differential pair: RX1_N, RX1_P, RX2_N, RX2_P, RX_N, RX_P, TX1_N, TX1_P, TX_N, TX_P

### Notes on the sheet
- Populate accordingly
- (in symbol HR911105A) J8; J7; J6 RX-; J5; J4; J3 RX+; J2 TX-; J1 TX+; 1000pF; 2KV; 75ohm; Green LED; Yellow LED
- (in symbol Title_Block) Title:; Project:; Size:; DrawnBy; Revision:; Date:; Time:; Sheet:; File:

### Library data of the parts
*#2 = Title_Block: Standart Title Block; Size: -
C1 C50 = GRT188C81C475ME13D: CAP CER 4.7UF 16V X6S 0603; manufacturer: Murata Electronics; Tolerance: ±20%; Part Number: GRT188C81C475ME13D; Value: 4.7 µF; Applications: Automotive; Capacitance: 4.7 µF; componentlink1description: Datasheet; componentlink1url: https://search.murata.co.jp/Ceramy/image/img/A01X/G101/ENG/GRT188C81C475ME13-01.pdf; componentlink2description: DigiKey Link; componentlink2url: https://www.digikey.com/en/products/detail/murata-electronics/GRT188C81C475ME13D/5416712; Device Package: 0603 (1608 Metric); lastupdated: 3/3/2023 08:08:51 PM; Lifecycle Status: Active; Minimum Order: 1; Mounting Type: Surface Mount, MLCC; Operating Temperature: -55°C ~ 105°C; Package / Case: 0603 (1608 Metric); packaging: TapeAndReel; partid: 2551; Part Status: Active; price: 0.02; Ratings: AEC-Q200; series: GRT; Size / Dimension: 0.063" L x 0.031" W (1.60mm x 0.80mm); Supplier 1: DigiKey; Supplier Part Number 1: 490-12290-1-ND; Temperature Coefficient: X6S; Thickness (Max): 0.035" (0.90mm); Voltage - Rated: 16V
C18-C24 C29 = CS0603KRX7R7BB104: as C2 on sheet STM32; Part Number: CS0603KRX7R7BB104; Value: 0.1 µF; Applications: Boardflex Sensitive; Capacitance: 0.1 µF; componentlink1description: Datasheet; componentlink1url: http://www.yageo.com/NewPortal/yageodocoutput?fileName=/pdf/MLCC/UPY-ST_NPOX7R_16V-to-3KV_5.pdf; componentlink2description: DigiKey Link; componentlink2url: https://www.digikey.com/en/products/detail/yageo/CS0603KRX7R7BB104/6097897; Device Package: 0603 (1608 Metric); Features: Soft Termination; lastupdated: 3/3/2023 08:08:52 PM; Lifecycle Status: Active; Minimum Order: 1; Mounting Type: Surface Mount, MLCC; Operating Temperature: -55°C ~ 125°C; Package / Case: 0603 (1608 Metric); packaging: TapeAndReel; partid: 2286; Part Status: Active; price: 0.01; series: CS; Size / Dimension: 0.063" L x 0.031" W (1.60mm x 0.80mm); Supplier 1: DigiKey; Supplier Part Number 1: 311-3560-1-ND; Temperature Coefficient: X7R; Thickness (Max): 0.037" (0.95mm); Voltage - Rated: 16V
C25 C32 C33 C35 = 0603YC103JAT2A: CAP CER 10000PF 16V X7R 0603; manufacturer: AVX Corporation; Tolerance: ±5%; Part Number: 0603YC103JAT2A; Value: 10000pF; Applications: General Purpose; Capacitance: 10000pF; componentlink1description: Datasheet; componentlink1url: http://datasheets.avx.com/X7RDielectric.pdf; componentlink2description: DigiKey Link; componentlink2url: http://digikey.com/product-detail/en/avx-corporation/0603YC103JAT2A/478-6208-1-ND/2391407; Device Package: 0603 (1608 Metric); lastupdated: 9/2/2020 01:03:35 AM; Lifecycle Status: Active; Minimum Order: 1; Mounting Type: Surface Mount, MLCC; Operating Temperature: -55°C ~ 125°C; Package / Case: 0603 (1608 Metric); packaging: TapeAndReel; partid: 2747; Part Status: Active; price: 0.02; series: -; Size / Dimension: 0.063" L x 0.032" W (1.60mm x 0.81mm); Supplier 1: DigiKey; Supplier Part Number 1: 478-6208-1-ND; Temperature Coefficient: X7R; Thickness (Max): 0.035" (0.90mm); Voltage - Rated: 16V
C26 C27 = 06035C682KAT2A: CAP CER 6800PF 50V X7R 0603; manufacturer: AVX Corporation; Tolerance: ±10%; Part Number: 06035C682KAT2A; Value: 6800pF; Applications: General Purpose; Capacitance: 6800pF; componentlink1description: Datasheet; componentlink1url: http://datasheets.avx.com/X7RDielectric.pdf; componentlink2description: DigiKey Link; componentlink2url: http://digikey.com/product-detail/en/avx-corporation/06035C682KAT2A/478-1225-1-ND/564257; Device Package: 0603 (1608 Metric); lastupdated: 9/2/2020 01:03:35 AM; Lifecycle Status: Active; Minimum Order: 1; Mounting Type: Surface Mount, MLCC; Operating Temperature: -55°C ~ 125°C; Package / Case: 0603 (1608 Metric); packaging: TapeAndReel; partid: 2828; Part Status: Active; price: 0.02; series: -; Size / Dimension: 0.063" L x 0.032" W (1.60mm x 0.81mm); Supplier 1: DigiKey; Supplier Part Number 1: 478-1225-1-ND; Temperature Coefficient: X7R; Thickness (Max): 0.035" (0.90mm); Voltage - Rated: 50V
C30 C31 = VJ0603A180JXACW1BC: CAP CER 18PF 50V C0G/NP0 0603; manufacturer: Vishay Vitramon; Temperature Coefficient: C0G, NP0; Tolerance: ±5%; Part Number: VJ0603A180JXACW1BC; Value: 18 pF; Applications: General Purpose; Capacitance: 18 pF; componentlink1description: Datasheet; componentlink1url: https://www.vishay.com/docs/28548/vjw1bcbascomseries.pdf; componentlink2description: DigiKey Link; componentlink2url: https://www.digikey.com/en/products/detail/vishay-vitramon/VJ0603A180JXACW1BC/420843; Device Package: 0603 (1608 Metric); lastupdated: 3/3/2023 08:08:47 PM; Lifecycle Status: Active; Minimum Order: 1; Mounting Type: Surface Mount, MLCC; Operating Temperature: -55°C ~ 125°C; Package / Case: 0603 (1608 Metric); packaging: TapeAndReel; partid: 4200; Part Status: Active; price: 0.01; series: VJ W1BC; Size / Dimension: 0.063" L x 0.031" W (1.60mm x 0.80mm); Supplier 1: DigiKey; Supplier Part Number 1: 720-1524-1-ND; Thickness (Max): 0.035" (0.90mm); Voltage - Rated: 50V
FB2 = 742792625: as FB1 on sheet STM32; Part Number: 742792625; ComponentLink1Description: Datasheet; ComponentLink1URL: https://katalog.we-online.de/pbs/datasheet/742792625.pdf; ComponentLink2Description: DigiKey Link; ComponentLink2URL: https://www.digikey.com/en/products/detail/würth-elektronik/742792625/4310426; Device Package: 0603 (1608 Metric); Height (Max): 0.039" (1.00mm); Impedance @ Frequency: 120 Ohms @ 100 MHz; LastUpdated: 3/3/2023 08:50:24 PM; Lifecycle Status: Active; Minimum Order: 1; Mounting Type: Surface Mount; Operating Temperature: -55°C ~ 125°C; Package / Case: 0603 (1608 Metric); Packaging: TapeAndReel; PartId: 1102; Part Status: Active; Price: 0.10; Ratings: AEC-Q200; Series: WE-CBF; Size / Dimension: 0.063" L x 0.032" W (1.60mm x 0.80mm); Supplier 1: DigiKey; Supplier Part Number 1: 732-4665-1-ND; Value: 120 Ohms @ 100 MHz
IC3 = W5500: Integrated Circuit; Manufacturer_Name: WIZnet Inc; Datasheet Link: http://wizwiki.net/wiki/lib/exe/fetch.php?media=products:w5500:w5500_ds_v106e_141230.pdf; Height: 1.6mm; Manufacturer_Part_Number: W5500; Mouser Part Number: 950-W5500; Mouser Price/Stock: https://www.mouser.co.uk/ProductDetail/WIZnet/W5500?qs=2vh%252B45pPFtzthUpYPd4pqA%3D%3D
J2 = HR911105A: DIP RJ45 Connector;; Package: None; MP: HR911105A; Value: *; Price: None; Availability: Unavailable
R20-R22 R34 R37 R38 = CRCW060310K0JNEA: as R9 on sheet STM32; Part Number: CRCW060310K0JNEA; Value: 10 kOhms; ComponentLink1Description: Datasheet; ComponentLink1URL: http://www.vishay.com/docs/20035/dcrcwe3.pdf; ComponentLink2Description: DigiKey Link; ComponentLink2URL: http://digikey.com/product-detail/en/vishay-dale/CRCW060310K0JNEA/541-10KGCT-ND/1179393; Composition: Thick Film; Device Package: 0603 (1608 Metric); Features: Automotive AEC-Q200; Height - Seated (Max): 0.020" (0.50mm); LastUpdated: 3/3/2023 08:29:48 PM; Lifecycle Status: Active; Minimum Order: 1; Number of Terminations: 2; Operating Temperature: -55°C ~ 155°C; Package / Case: 0603 (1608 Metric); Packaging: CutTape; PartId: 5216; Part Status: Active; Price: 0.10; Ratings: AEC-Q200; Resistance: 10 kOhms; Series: CRCW; Size / Dimension: 0.063" L x 0.033" W (1.60mm x 0.85mm); Supplier 1: DigiKey; Supplier Part Number 1: 541-10KGCT-ND; Supplier Device Package: 0603; Tolerance: ±5%
R23 R24 R31 R32 = ERJ-3EKF49R9V: RES SMD 49.9 OHM 1% 1/10W 0603; Manufacturer: Panasonic Electronic Components; Power (Watts): 0.1W, 1/10W; Temperature Coefficient: ±100ppm/°C; Part Number: ERJ-3EKF49R9V; Value: 49.9 Ohms; ComponentLink1Description: Datasheet; ComponentLink1URL: https://industrial.panasonic.com/cdbs/www-data/pdf/RDA0000/AOA0000C304.pdf; ComponentLink2Description: DigiKey Link; ComponentLink2URL: https://www.digikey.com/en/products/detail/panasonic-electronic-components/ERJ-3EKF49R9V/196378; Composition: Thick Film; Device Package: 0603 (1608 Metric); Features: Automotive AEC-Q200; Height - Seated (Max): 0.022" (0.55mm); LastUpdated: 3/3/2023 08:29:47 PM; Lifecycle Status: Active; Minimum Order: 1; Number of Terminations: 2; Operating Temperature: -55°C ~ 155°C; Package / Case: 0603 (1608 Metric); Packaging: TapeAndReel; PartId: 5641; Part Status: Active; Price: 0.01; Ratings: AEC-Q200; Resistance: 49.9 Ohms; Series: ERJ-3EK; Size / Dimension: 0.063" L x 0.031" W (1.60mm x 0.80mm); Supplier 1: DigiKey; Supplier Part Number 1: P49.9HCT-ND; Supplier Device Package: 0603; Tolerance: ±1%
R25 = ERJ-3EKF10R0V: RES SMD 10 OHM 1% 1/10W 0603; Manufacturer: Panasonic Electronic Components; Power (Watts): 0.1W, 1/10W; Temperature Coefficient: ±100ppm/°C; Part Number: ERJ-3EKF10R0V; Value: 10 Ohms; ComponentLink1Description: Datasheet; ComponentLink1URL: https://industrial.panasonic.com/cdbs/www-data/pdf/RDA0000/AOA0000C304.pdf; ComponentLink2Description: DigiKey Link; ComponentLink2URL: https://www.digikey.com/en/products/detail/panasonic-electronic-components/ERJ-3EKF10R0V/196065; Composition: Thick Film; Device Package: 0603 (1608 Metric); Features: Automotive AEC-Q200; Height - Seated (Max): 0.022" (0.55mm); LastUpdated: 3/3/2023 08:29:47 PM; Lifecycle Status: Active; Minimum Order: 1; Number of Terminations: 2; Operating Temperature: -55°C ~ 155°C; Package / Case: 0603 (1608 Metric); Packaging: TapeAndReel; PartId: 5647; Part Status: Active; Price: 0.01; Ratings: AEC-Q200; Resistance: 10 Ohms; Series: ERJ-3EK; Size / Dimension: 0.063" L x 0.031" W (1.60mm x 0.80mm); Supplier 1: DigiKey; Supplier Part Number 1: P10.0HCT-ND; Supplier Device Package: 0603; Tolerance: ±1%
R26-R30 = RMCF0603JT33R0: as R4 on sheet STM32; Part Number: RMCF0603JT33R0; Value: 33 Ohms; ComponentLink1Description: Datasheet; ComponentLink1URL: https://www.seielect.com/catalog/sei-rmcf_rmcp.pdf; ComponentLink2Description: DigiKey Link; ComponentLink2URL: https://www.digikey.com/en/products/detail/stackpole-electronics-inc/RMCF0603JT33R0/1758048; Composition: Thick Film; Device Package: 0603 (1608 Metric); Features: Automotive AEC-Q200; Height - Seated (Max): 0.022" (0.55mm); LastUpdated: 3/3/2023 08:29:46 PM; Lifecycle Status: Active; Minimum Order: 1; Number of Terminations: 2; Operating Temperature: -55°C ~ 155°C; Package / Case: 0603 (1608 Metric); Packaging: CutTape; PartId: 5849; Part Status: Active; Price: 0.01; Ratings: AEC-Q200; Resistance: 33 Ohms; Series: RMCF; Size / Dimension: 0.061" L x 0.031" W (1.55mm x 0.80mm); Supplier 1: DigiKey; Supplier Part Number 1: RMCF0603JT33R0CT-ND; Supplier Device Package: 0603; Tolerance: ±5%
R33 = RNCP0603FTD12K4: RES 12.4K OHM 1% 1/8W 0603; Manufacturer: Stackpole Electronics Inc; Power (Watts): 0.125W, 1/8W; Temperature Coefficient: ±100ppm/°C; Part Number: RNCP0603FTD12K4; Value: 12.4 kOhms; ComponentLink1Description: Datasheet; ComponentLink1URL: https://www.seielect.com/catalog/sei-rncp.pdf; ComponentLink2Description: DigiKey Link; ComponentLink2URL: https://www.digikey.com/en/products/detail/stackpole-electronics-inc/RNCP0603FTD12K4/2240143; Composition: Thin Film; Device Package: 0603 (1608 Metric); Features: Anti-Sulfur; Height - Seated (Max): 0.022" (0.55mm); LastUpdated: 3/3/2023 08:29:47 PM; Lifecycle Status: Active; Minimum Order: 1; Number of Terminations: 2; Operating Temperature: -55°C ~ 155°C; Package / Case: 0603 (1608 Metric); Packaging: TapeAndReel; PartId: 5715; Part Status: Active; Price: 0.01; Resistance: 12.4 kOhms; Series: RNCP; Size / Dimension: 0.061" L x 0.031" W (1.55mm x 0.80mm); Supplier 1: DigiKey; Supplier Part Number 1: RNCP0603FTD12K4CT-ND; Supplier Device Package: 0603; Tolerance: ±1%
R35 R36 = RMCF0603JT510R: as R2 on sheet STM32; Part Number: RMCF0603JT510R; Value: 510 Ohms; ComponentLink1Description: Datasheet; ComponentLink1URL: https://www.seielect.com/catalog/sei-rmcf_rmcp.pdf; ComponentLink2Description: DigiKey Link; ComponentLink2URL: https://www.digikey.com/en/products/detail/stackpole-electronics-inc/RMCF0603JT510R/1757941; Composition: Thick Film; Device Package: 0603 (1608 Metric); Features: Automotive AEC-Q200; Height - Seated (Max): 0.022" (0.55mm); LastUpdated: 3/3/2023 08:29:46 PM; Lifecycle Status: Active; Minimum Order: 1; Number of Terminations: 2; Operating Temperature: -55°C ~ 155°C; Package / Case: 0603 (1608 Metric); Packaging: CutTape; PartId: 5929; Part Status: Active; Price: 0.01; Ratings: AEC-Q200; Resistance: 510 Ohms; Series: RMCF; Size / Dimension: 0.061" L x 0.031" W (1.55mm x 0.80mm); Supplier 1: DigiKey; Supplier Part Number 1: RMCF0603JT510RCT-ND; Supplier Device Package: 0603; Tolerance: ±5%
Y2 = TSX-3225 25.0000MF10P-C0: CRYSTAL 25.0000MHZ 18PF SMD; Manufacturer: EPSON; ESR (Equivalent Series Resistance): 40 Ohms; Frequency Stability: ±10ppm; Operating Mode: Fundamental; Part Number: TSX-3225 25.0000MF10P-C0; ComponentLink1Description: Datasheet; ComponentLink1URL: https://support.epson.biz/td/api/doc_check.php?dl=brief_TSX-3225&lang=en; ComponentLink2Description: DigiKey Link; ComponentLink2URL: https://www.digikey.com/en/products/detail/epson/TSX-3225-25-0000MF10P-C0/7430946; Frequency: 25 MHz; Frequency Tolerance: ±10ppm; Height - Seated (Max): 0.024" (0.60mm); LastUpdated: 3/3/2023 08:58:01 PM; Lifecycle Status: Active; Load Capacitance: 18pF; Minimum Order: 1; Mounting Type: Surface Mount; Operating Temperature: -20°C ~ 85°C; Package / Case: 4-SMD, No Lead; Packaging: TapeAndReel; PartId: 450; Part Status: Active; Price: 0.20; Series: TSX-3225; Size / Dimension: 0.126" L x 0.098" W (3.20mm x 2.50mm); Supplier 1: DigiKey; Supplier Part Number 1: SER4211CT-ND; Type: MHz Crystal; Value: 25 MHz

## Sheet Serial.SchDoc: Serial
size A3; Author: Orhun DABAK; DrawnBy: Orhun DABAK; Revision: 1.0; SheetNumber: 3; SheetTotal: 3
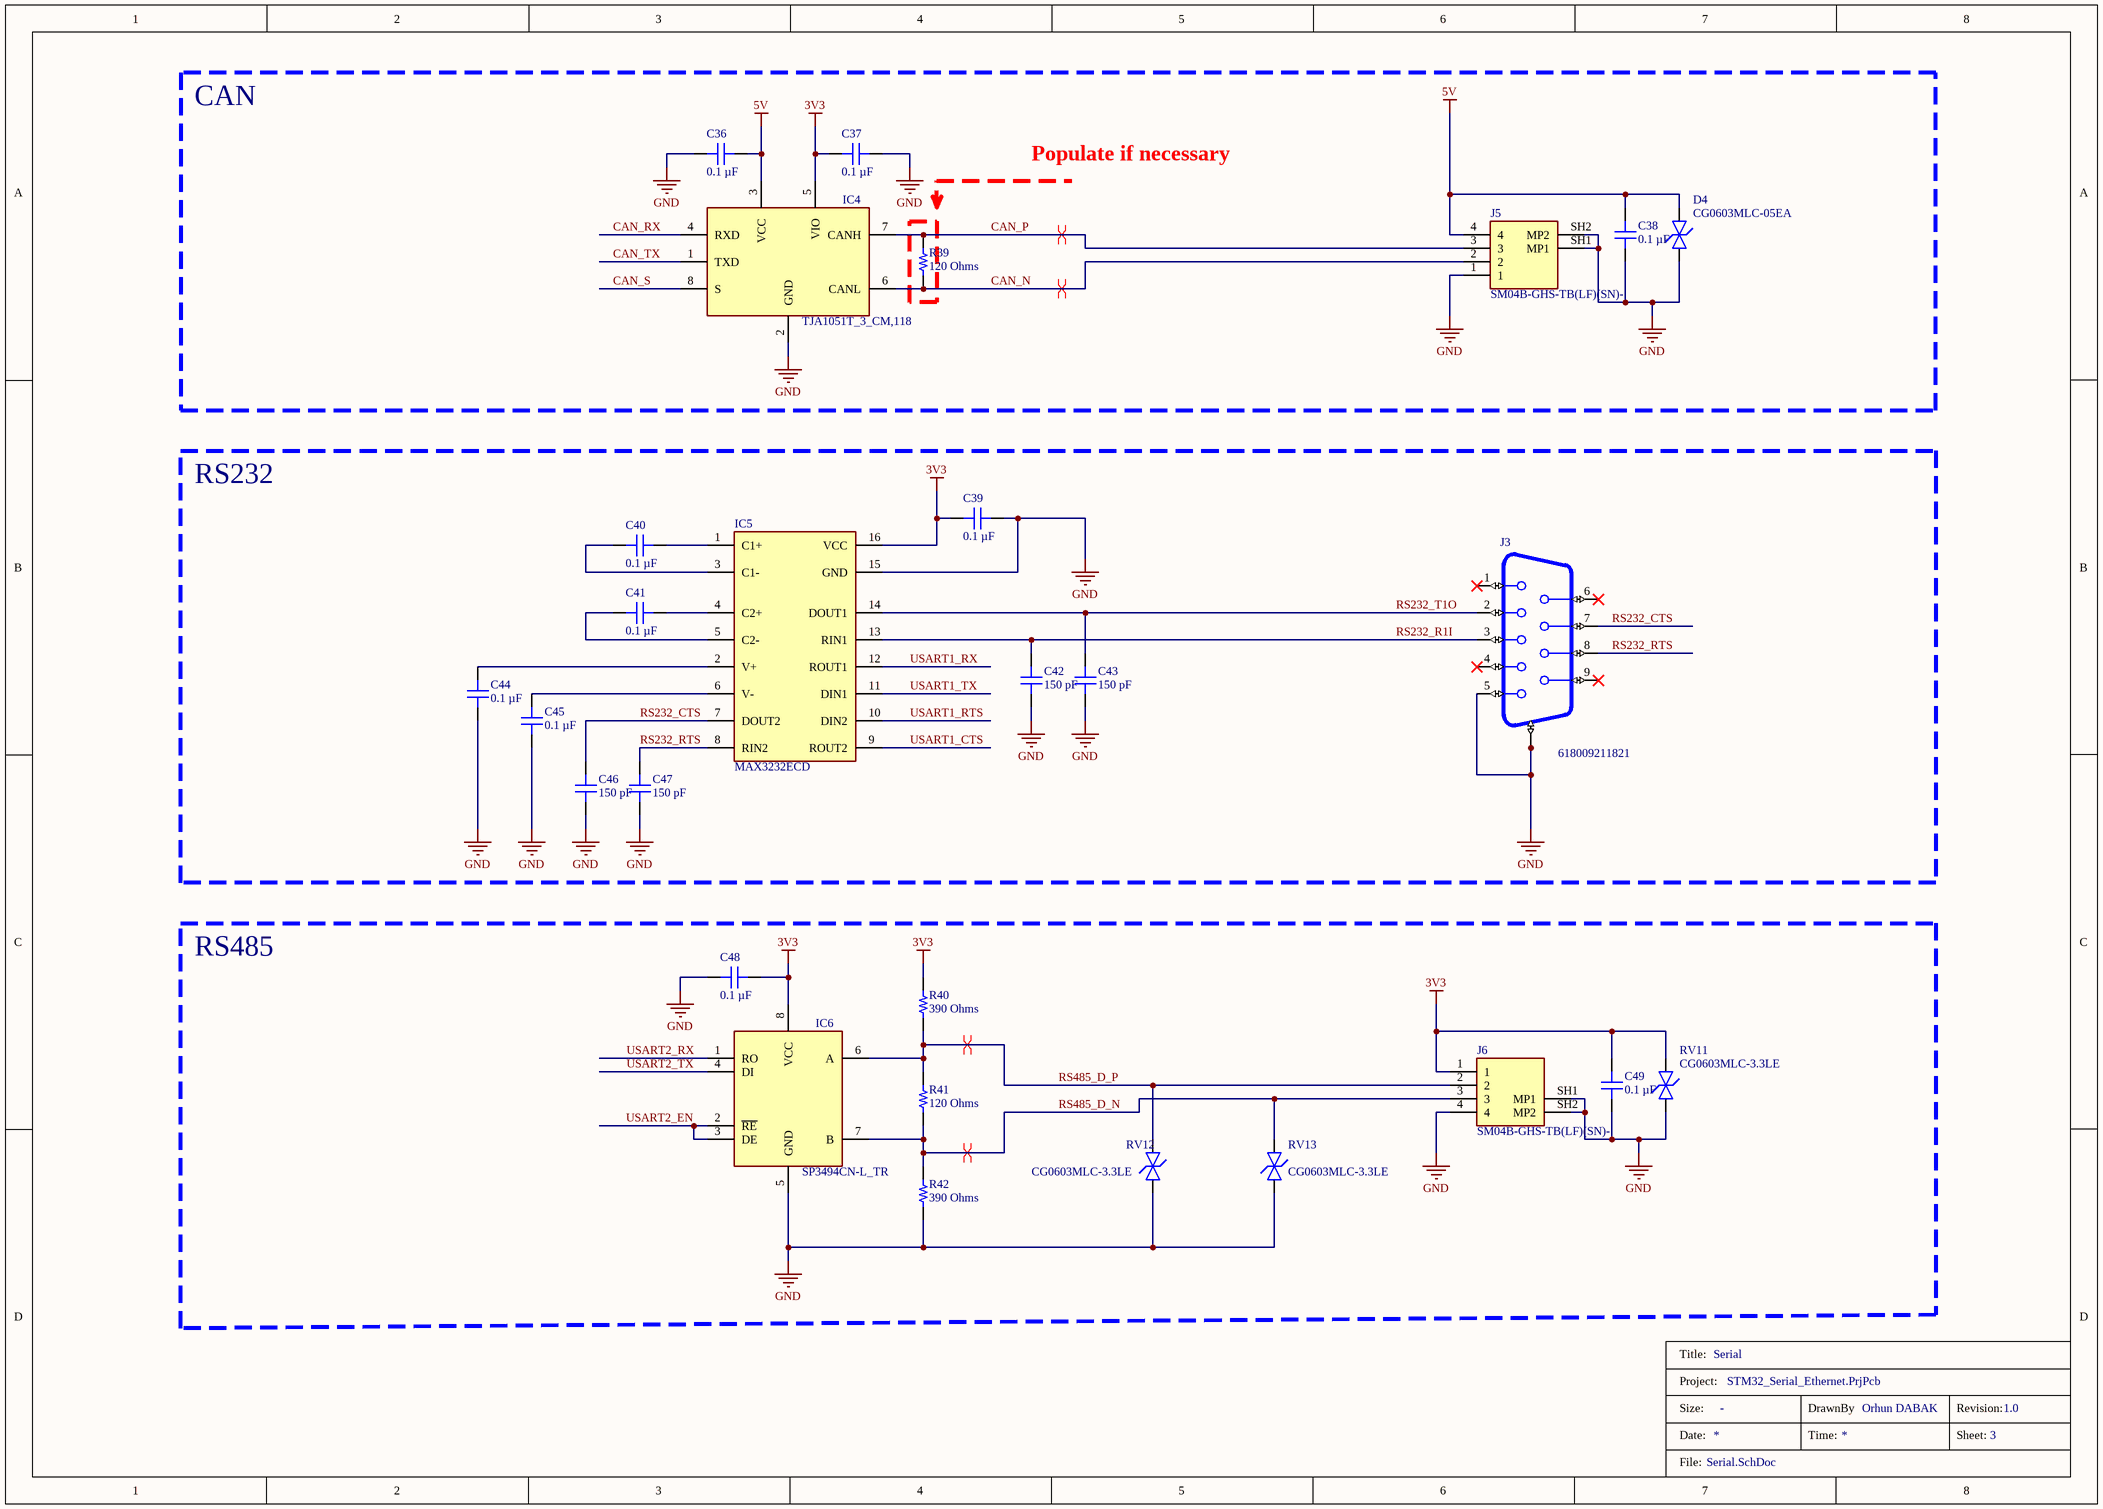
[diagram p2: Serial.SchDoc]

### Parts
(Parts that share a designator on the sheet are numbered #1, #2 ... from top to bottom, then left to right.)
*#3  Title_Block  (value not drawn)  (graphical)
C36  0.1 µF  [CAP 0603_1608]
C37  0.1 µF  [CAP 0603_1608]
C38  0.1 µF  [CAP 0603_1608]
C39  0.1 µF  [CAP 0603_1608]
C40  0.1 µF  [CAP 0603_1608]
C41  0.1 µF  [CAP 0603_1608]
C42  150 pF  [CAP 0603_1608]
C43  150 pF  [CAP 0603_1608]
C44  0.1 µF  [CAP 0603_1608]
C45  0.1 µF  [CAP 0603_1608]
C46  150 pF  [CAP 0603_1608]
C47  150 pF  [CAP 0603_1608]
C48  0.1 µF  [CAP 0603_1608]
C49  0.1 µF  [CAP 0603_1608]
D4  CG0603MLC-05EA  [DIONC1608X55N]
IC4  TJA1051T_3_CM,118  [SOIC127P600X175-8N]
IC5  MAX3232ECD  [SOIC127P600X175-16N]
IC6  SP3494CN-L_TR  [SOIC127P600X175-8N]
J3  618009211821  [618009211821]
J5  SM04B-GHS-TB(LF)(SN)-  [JST_SM04B-GHS-TB(LF)(SN)-]
J6  SM04B-GHS-TB(LF)(SN)-  [JST_SM04B-GHS-TB(LF)(SN)-]
R39  120 Ohms  [RES 0603_1608]
R40  390 Ohms  [RES 0603_1608]
R41  120 Ohms  [RES 0603_1608]
R42  390 Ohms  [RES 0603_1608]
RV11  CG0603MLC-3.3LE  [VARC1608X55N]
RV12  CG0603MLC-3.3LE  [VARC1608X55N]
RV13  CG0603MLC-3.3LE  [VARC1608X55N]

### Blocks framed on the sheet
CAN: C36-C38 D4 IC4 J5 R39
RS232: C39-C47 IC5 J3
RS485: C48 C49 IC6 J6 R40-R42 RV11-RV13

### Nets
3V3: C37.2 C39.2 C48.1 C49.2 IC4.5(VIO) IC5.16(VCC) IC6.8(VCC) J6.1 R40.2 RV11.2
5V: C36.1 C38.2 D4.2 IC4.3(VCC) J5.4
GND: C36.2 C37.1 C38.1 C39.1 C42.1 C43.1 C44.1 C45.1 C46.1 C47.1 C48.2 C49.1 D4.1 IC4.2(GND) IC5.15(GND) IC6.5(GND) J3.5 J3.Z1(SHIELD) J3.Z2(SHIELD) J5.1 J5.SH1(MP1) J5.SH2(MP2) J6.4 J6.SH1(MP1) J6.SH2(MP2) R42.1 RV11.1 RV12.1 RV13.1
CAN_N: IC4.6(CANL) J5.2 R39.1
CAN_P: IC4.7(CANH) J5.3 R39.2
CAN_RX: IC4.4(RXD)
CAN_S: IC4.8(S)
CAN_TX: IC4.1(TXD)
RS232_CTS: C46.2 IC5.7(DOUT2) J3.7
RS232_R1I: C42.2 IC5.13(RIN1) J3.3
RS232_RTS: C47.2 IC5.8(RIN2) J3.8
RS232_T1O: C43.2 IC5.14(DOUT1) J3.2
RS485_D_N: IC6.7(B) J6.3 R41.1 R42.2 RV13.2
RS485_D_P: IC6.6(A) J6.2 R40.1 R41.2 RV12.2
USART1_CTS: IC5.9(ROUT2)
USART1_RTS: IC5.10(DIN2)
USART1_RX: IC5.12(ROUT1)
USART1_TX: IC5.11(DIN1)
USART2_EN: IC6.2(~{RE}) IC6.3(DE)
USART2_RX: IC6.1(RO)
USART2_TX: IC6.4(DI)
NetC40_1: C40.1 IC5.1(C1+)
NetC40_2: C40.2 IC5.3(C1-)
NetC41_1: C41.1 IC5.4(C2+)
NetC41_2: C41.2 IC5.5(C2-)
NetC44_2: C44.2 IC5.2(V+)
NetC45_2: C45.2 IC5.6(V-)

Not connected (* = marked no-connect by the designer): J3 1* 4* 6* 9*

### Layout directives
differential pair: CAN_N, CAN_P, RS485_D_N, RS485_D_P

### Notes on the sheet
- Populate if necessary
- (in symbol Title_Block) Title:; Project:; Size:; DrawnBy; Revision:; Date:; Time:; Sheet:; File:

### Library data of the parts
*#3 = Title_Block: Standart Title Block; Size: -
C36-C41 C44 C45 C48 C49 = CS0603KRX7R7BB104: as C2 on sheet STM32; Part Number: CS0603KRX7R7BB104; Value: 0.1 µF; Applications: Boardflex Sensitive; Capacitance: 0.1 µF; componentlink1description: Datasheet; componentlink1url: http://www.yageo.com/NewPortal/yageodocoutput?fileName=/pdf/MLCC/UPY-ST_NPOX7R_16V-to-3KV_5.pdf; componentlink2description: DigiKey Link; componentlink2url: https://www.digikey.com/en/products/detail/yageo/CS0603KRX7R7BB104/6097897; Device Package: 0603 (1608 Metric); Features: Soft Termination; lastupdated: 3/3/2023 08:08:52 PM; Lifecycle Status: Active; Minimum Order: 1; Mounting Type: Surface Mount, MLCC; Operating Temperature: -55°C ~ 125°C; Package / Case: 0603 (1608 Metric); packaging: TapeAndReel; partid: 2286; Part Status: Active; price: 0.01; series: CS; Size / Dimension: 0.063" L x 0.031" W (1.60mm x 0.80mm); Supplier 1: DigiKey; Supplier Part Number 1: 311-3560-1-ND; Temperature Coefficient: X7R; Thickness (Max): 0.037" (0.95mm); Voltage - Rated: 16V
C42 C43 C46 C47 = 885012206029: CAP CER 150PF 16V X7R 0603; manufacturer: Würth Elektronik; Tolerance: ±10%; Part Number: 885012206029; Value: 150 pF; Applications: General Purpose; Capacitance: 150 pF; componentlink1description: Datasheet; componentlink1url: https://katalog.we-online.de/pbs/datasheet/885012206029.pdf; componentlink2description: DigiKey Link; componentlink2url: https://www.digikey.com/en/products/detail/würth-elektronik/885012206029/5453803; Device Package: 0603 (1608 Metric); lastupdated: 3/3/2023 08:08:49 PM; Lifecycle Status: Active; Minimum Order: 1; Mounting Type: Surface Mount, MLCC; Operating Temperature: -55°C ~ 125°C; Package / Case: 0603 (1608 Metric); packaging: TapeAndReel; partid: 3529; Part Status: Active; price: 0.02; series: WCAP-CSGP; Size / Dimension: 0.063" L x 0.031" W (1.60mm x 0.80mm); Supplier 1: DigiKey; Supplier Part Number 1: 732-7948-1-ND; Temperature Coefficient: X7R; Thickness (Max): 0.034" (0.87mm); Voltage - Rated: 16V
D4 = CG0603MLC-05EA: as D1 on sheet STM32; Datasheet Link: https://datasheet.datasheetarchive.com/originals/dk/DKDS-12/224862.pdf; Height: 0.55mm; Manufacturer_Part_Number: CG0603MLC-05EA
IC4 = TJA1051T_3_CM,118: Integrated Circuit; Manufacturer_Name: NXP; Manufacturer_Part_Number: TJA1051T/3/CM,118; Datasheet Link: http://www.nxp.com/docs/en/data-sheet/TJA1051.pdf; Height: 1.75mm; Mouser Part Number: 771-TJA1051T/3CM118; Mouser Price/Stock: https://www.mouser.co.uk/ProductDetail/NXP-Semiconductors/TJA1051T-3-CM118?qs=5XOdhvmYM0NUkmo%252BpXvJfw%3D%3D; Arrow Part Number: TJA1051T/3/CM,118; Arrow Price/Stock: https://www.arrow.com/en/products/tja1051t3cm118/nxp-semiconductors?region=nac
IC5 = MAX3232ECD: Integrated Circuit; Manufacturer_Name: Texas Instruments; Datasheet Link: http://www.ti.com/lit/gpn/max3232e; Height: 1.75mm; Manufacturer_Part_Number: MAX3232ECD; Mouser Part Number: 595-MAX3232ECD; Mouser Price/Stock: https://www.mouser.co.uk/ProductDetail/Texas-Instruments/MAX3232ECD?qs=paYhMW8qfisAgX9h7jy%2FVw%3D%3D; Arrow Part Number: MAX3232ECD; Arrow Price/Stock: https://www.arrow.com/en/products/max3232ecd/texas-instruments?region=nac
IC6 = SP3494CN-L_TR: Integrated Circuit; Manufacturer_Name: MaxLinear; Manufacturer_Part_Number: SP3494CN-L/TR; Datasheet Link: https://www.arrow.com/en/products/sp3494cn-ltr/maxlinear-inc?region=nac; Height: 1.75mm; Mouser Part Number: 701-SP3494CN-L/TR; Mouser Price/Stock: https://www.mouser.co.uk/ProductDetail/MaxLinear/SP3494CN-L-TR?qs=3EMgrMjM0faUFCPV%252BPTaUQ%3D%3D; Arrow Part Number: SP3494CN-L/TR; Arrow Price/Stock: https://www.arrow.com/en/products/sp3494cn-ltr/maxlinear-inc?region=nac
J3 = 618009211821: 9 Position D-Sub Receptacle, Female Sockets Connector; MF: WÃ¼rth Elektronik; Value: *; Availability: In Stock; SnapEDA_Link: https://www.snapeda.com/parts/618009211821/Wurth+Elektronik/view-part/?ref=snap; Check_prices: https://www.snapeda.com/parts/618009211821/Wurth+Elektronik/view-part/?ref=eda; Package: None; Purchase-URL: https://pricing.snapeda.com/search/part/618009211821/?ref=eda; MP: 618009211821; Price: None
J5 J6 = SM04B-GHS-TB(LF)(SN)-: Connector Header Surface Mount, Right Angle 4 position 0.049 _1.25mm_; MP: SM04B-GHS-TB_LF__SN_-; MF: JST Sales; Availability: Unavailable; Package: None; Value: *; Price: None; SnapEDA_Link: https://www.snapeda.com/parts/SM04B-GHS-TB%28LF%29%28SN%29-/JST%20Sales%20America%20Inc./view-part/2759740/?ref=snap
R39 R41 = CRCW0603120RJNEA: RES SMD 120 OHM 5% 1/10W 0603; Manufacturer: Vishay Dale; Power (Watts): 0.1W, 1/10W; Temperature Coefficient: ±200ppm/°C; Part Number: CRCW0603120RJNEA; Value: 120 Ohms; ComponentLink1Description: Datasheet; ComponentLink1URL: http://www.vishay.com/docs/20035/dcrcwe3.pdf; ComponentLink2Description: DigiKey Link; ComponentLink2URL: https://www.digikey.com/en/products/detail/vishay-dale/CRCW0603120RJNEA/1174207; Composition: Thick Film; Device Package: 0603 (1608 Metric); Features: Automotive AEC-Q200; Height - Seated (Max): 0.020" (0.50mm); LastUpdated: 3/3/2023 08:29:48 PM; Lifecycle Status: Active; Minimum Order: 1; Number of Terminations: 2; Operating Temperature: -55°C ~ 155°C; Package / Case: 0603 (1608 Metric); Packaging: CutTape; PartId: 5196; Part Status: Active; Price: 0.01; Ratings: AEC-Q200; Resistance: 120 Ohms; Series: CRCW; Size / Dimension: 0.063" L x 0.033" W (1.60mm x 0.85mm); Supplier 1: DigiKey; Supplier Part Number 1: 541-120GCT-ND; Supplier Device Package: 0603; Tolerance: ±5%
R40 R42 = CRGP0603F390R: RES 390 OHM 1% 1/4W 0603; Manufacturer: TE Connectivity Passive Product; Power (Watts): 0.25W, 1/4W; Temperature Coefficient: ±100ppm/°C; Part Number: CRGP0603F390R; Value: 390 Ohms; ComponentLink1Description: Datasheet; ComponentLink1URL: https://www.te.com/commerce/DocumentDelivery/DDEController?Action=srchrtrv&DocNm=9-1773463-9&DocType=DS&DocLang=English; ComponentLink2Description: DigiKey Link; ComponentLink2URL: https://www.digikey.com/en/products/detail/te-connectivity-passive-product/CRGP0603F390R/8577013; Composition: Thick Film; Device Package: 0603 (1608 Metric); Features: Pulse Withstanding; Height - Seated (Max): 0.022" (0.55mm); LastUpdated: 3/3/2023 08:29:49 PM; Lifecycle Status: Active; Minimum Order: 1; Number of Terminations: 2; Operating Temperature: -55°C ~ 155°C; Package / Case: 0603 (1608 Metric); Packaging: TapeAndReel; PartId: 5035; Part Status: Active; Price: 0.02; Resistance: 390 Ohms; Series: CRGP; Size / Dimension: 0.063" L x 0.031" W (1.60mm x 0.80mm); Supplier 1: DigiKey; Supplier Part Number 1: A130411CT-ND; Supplier Device Package: 0603; Tolerance: ±1%
RV11-RV13 = CG0603MLC-3.3LE: Varistor; Manufacturer_Name: Bourns; Datasheet Link: https://www.bourns.com/docs/Product-Datasheets/MLC.pdf; Height: 0.55mm; Manufacturer_Part_Number: CG0603MLC-3.3LE; Mouser Part Number: 652-CG0603MLC-3.3LE; Mouser Price/Stock: https://www.mouser.co.uk/ProductDetail/Bourns/CG0603MLC-3.3LE?qs=m8myXnDJXpXlL5%252BDNWWe1g%3D%3D; Arrow Part Number: CG0603MLC-3.3LE; Arrow Price/Stock: https://www.arrow.com/en/products/cg0603mlc-3.3le/bourns?region=nac

## Nets that join several sheets
3V3: STM32 (23 pins), Ethernet (12 pins), Serial (10 pins)
5V: STM32 (5 pins), Serial (5 pins)
GND: STM32 (47 pins), Ethernet (27 pins), Serial (29 pins)
CAN_RX: STM32 (IC2.45), Serial (IC4.4)
CAN_S: STM32 (IC2.43), Serial (IC4.8)
CAN_TX: STM32 (IC2.46), Serial (IC4.1)
INTn: STM32 (IC2.19), Ethernet (IC3.36 R37.2)
RSTn: STM32 (IC2.18), Ethernet (IC3.37 R38.1)
SPI1_MISO: STM32 (IC2.16), Ethernet (IC3.34)
SPI1_MOSI: STM32 (IC2.17), Ethernet (IC3.35)
SPI1_SCK: STM32 (IC2.15), Ethernet (IC3.33)
SPI1_SS: STM32 (IC2.14), Ethernet (IC3.32)
USART1_CTS: STM32 (IC2.32), Serial (IC5.9)
USART1_RTS: STM32 (IC2.33), Serial (IC5.10)
USART1_RX: STM32 (IC2.31), Serial (IC5.12)
USART1_TX: STM32 (IC2.30), Serial (IC5.11)
USART2_EN: STM32 (IC2.11), Serial (IC6.2 IC6.3)
USART2_RX: STM32 (IC2.13), Serial (IC6.1)
USART2_TX: STM32 (IC2.12), Serial (IC6.4)